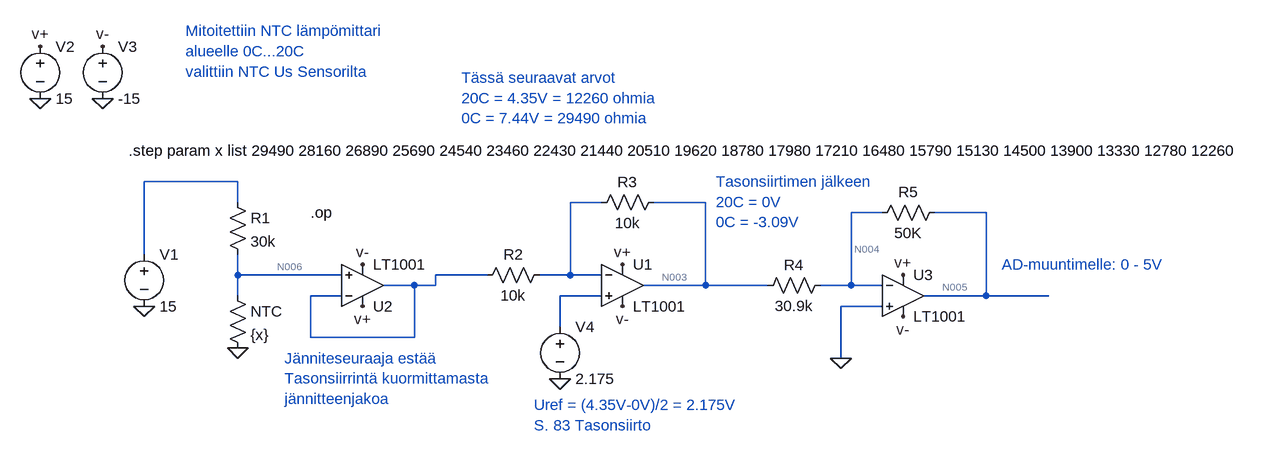
[diagram p0: schematic NTC_lämpötila_anturi.asc]
NTC_lämpötila_anturi.asc, the LTspice schematic file:
Version 4
SHEET 1 1972 680
WIRE -464 176 -608 176
WIRE -464 208 -464 176
WIRE 96 208 48 208
WIRE 256 208 176 208
WIRE 528 224 480 224
WIRE 688 224 608 224
WIRE -608 288 -608 176
WIRE -464 320 -464 288
WIRE -304 320 -464 320
WIRE -80 320 -160 320
WIRE 48 320 48 208
WIRE 48 320 0 320
WIRE 96 320 48 320
WIRE -192 336 -240 336
WIRE -160 336 -160 320
WIRE -160 336 -192 336
WIRE 256 336 256 208
WIRE 256 336 160 336
WIRE 352 336 256 336
WIRE 480 336 480 224
WIRE 480 336 432 336
WIRE 528 336 480 336
WIRE -464 352 -464 320
WIRE -304 352 -352 352
WIRE 96 352 32 352
WIRE 688 352 688 224
WIRE 688 352 592 352
WIRE 784 352 688 352
WIRE 528 368 464 368
WIRE 32 400 32 352
WIRE -352 416 -352 352
WIRE -192 416 -192 336
WIRE -192 416 -352 416
WIRE 464 448 464 368
FLAG -608 368 0
FLAG -464 432 0
FLAG -768 48 0
FLAG -672 48 0
FLAG 32 480 0
FLAG 128 368 v-
FLAG -672 -32 v-
FLAG 128 304 v+
FLAG -768 -32 v+
FLAG -272 368 v+
FLAG -272 304 v-
FLAG 560 384 v-
FLAG 560 320 v+
FLAG 464 448 0
SYMBOL res -480 192 R0
SYMATTR InstName R1
SYMATTR Value 30k
SYMBOL res -480 336 R0
SYMATTR InstName NTC
SYMATTR Value {x}
SYMBOL voltage -608 272 R0
WINDOW 123 0 0 Left 2
WINDOW 39 0 0 Left 2
SYMATTR InstName V1
SYMATTR Value 15
SYMBOL Opamps\\LT1001 128 272 R0
SYMATTR InstName U1
SYMBOL voltage -768 -48 R0
WINDOW 123 0 0 Left 2
WINDOW 39 0 0 Left 2
SYMATTR InstName V2
SYMATTR Value 15
SYMBOL voltage -672 -48 R0
WINDOW 123 0 0 Left 2
WINDOW 39 0 0 Left 2
SYMATTR InstName V3
SYMATTR Value -15
SYMBOL voltage 32 384 R0
WINDOW 123 0 0 Left 2
WINDOW 39 0 0 Left 2
SYMATTR InstName V4
SYMATTR Value 2.175
SYMBOL res 16 304 R90
WINDOW 0 0 56 VBottom 2
WINDOW 3 32 56 VTop 2
SYMATTR InstName R2
SYMATTR Value 10k
SYMBOL res 192 192 R90
WINDOW 0 0 56 VBottom 2
WINDOW 3 32 56 VTop 2
SYMATTR InstName R3
SYMATTR Value 10k
SYMBOL Opamps\\LT1001 -272 400 M180
SYMATTR InstName U2
SYMBOL Opamps\\LT1001 560 288 R0
SYMATTR InstName U3
SYMBOL res 448 320 R90
WINDOW 0 0 56 VBottom 2
WINDOW 3 32 56 VTop 2
SYMATTR InstName R4
SYMATTR Value 30.9k
SYMBOL res 624 208 R90
WINDOW 0 0 56 VBottom 2
WINDOW 3 32 56 VTop 2
SYMATTR InstName R5
SYMATTR Value 50K
TEXT -632 128 Left 2 !.step param x list 29490 28160 26890 25690 24540 23460 22430 21440 20510 19620 18780 17980 17210 16480 15790 15130 14500 13900 13330 12780 12260
TEXT -352 224 Left 2 !.op
TEXT -544 -56 Left 2 ;Mitoitettiin NTC lämpömittari\nalueelle 0C...20C\nvalittiin NTC Us Sensorilta
TEXT -120 16 Left 2 ;Tässä seuraavat arvot\n20C = 4.35V = 12260 ohmia\n0C = 7.44V = 29490 ohmia
TEXT 272 176 Left 2 ;Tasonsiirtimen jälkeen\n20C = 0V\n0C = -3.09V
TEXT 712 304 Left 2 ;AD-muuntimelle: 0 - 5V
TEXT -392 448 Left 2 ;Jänniteseuraaja estää \nTasonsiirrintä kuormittamasta\njännitteenjakoa
TEXT -8 520 Left 2 ;Uref = (4.35V-0V)/2 = 2.175V\nS. 83 Tasonsiirto

The netlist it stands for:
* NTC_lämpötila_anturi.asc
R1 N001 N006 30k
R§NTC N006 0 {x}
V1 N001 0 15
XU1 N008 N002 v+ v- N003 LT1001  ; pins In+ In- V+ V- OUT
V2 v+ 0 15
V3 v- 0 -15
V4 N008 0 2.175
R2 N002 N007 10k
R3 N003 N002 10k
XU2 N006 N007 v+ v- N007 LT1001  ; pins In+ In- V+ V- OUT
XU3 0 N004 v+ v- N005 LT1001  ; pins In+ In- V+ V- OUT
R4 N004 N003 30.9k
R5 N005 N004 50K
.step param x list 29490 28160 26890 25690 24540 23460 22430 21440 20510 19620 18780 17980 17210 16480 15790 15130 14500 13900 13330 12780 12260
.op
* Mitoitettiin NTC lämpömittari
* alueelle 0C...20C
* valittiin NTC Us Sensorilta
* Tässä seuraavat arvot
* 20C = 4.35V = 12260 ohmia
* 0C = 7.44V = 29490 ohmia
* Tasonsiirtimen jälkeen
* 20C = 0V
* 0C = -3.09V
* AD-muuntimelle: 0 - 5V
* Jänniteseuraaja estää
* Tasonsiirrintä kuormittamasta
* jännitteenjakoa
* Uref = (4.35V-0V)/2 = 2.175V
* S. 83 Tasonsiirto
.lib LTC.lib
.backanno
.end

* Results of the author's LTspice run, read from the files saved beside the schematic
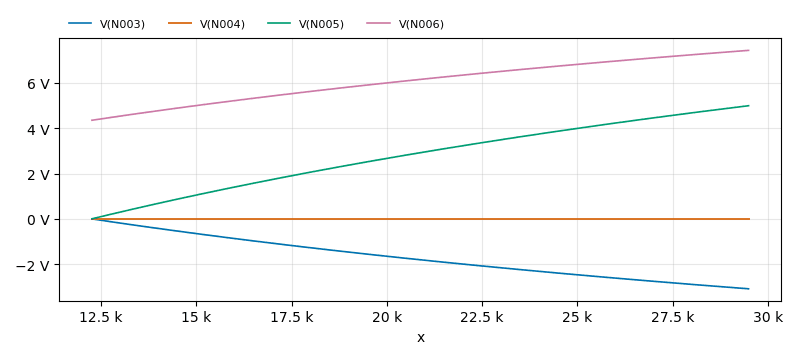
[diagram p1: Operating Point of NTC_lämpötila_anturi.asc, plotted from the saved traces]
* Operating Point, 1 run:
*   V(N003): -3.086 V at x=29.49 k, -1.627 mV at x=12.26 k, min -3.086 V, max -1.627 mV
*   V(N004): -6.694 µV at x=29.49 k, -3.529 nV at x=12.26 k, min -6.694 µV, max -3.529 nV
*   V(N005): 4.993 V at x=29.49 k, 2.632 mV at x=12.26 k, min 2.632 mV, max 4.993 V
*   V(N006): 7.436 V at x=29.49 k, 4.352 V at x=12.26 k, min 4.352 V, max 7.436 V
* From the log:
*   Semiconductor Device Operating Points:
*                           --- Diodes ---
*   Name:    d:u3:4      d:u3:1      d:u2:4      d:u2:1      d:u1:4
*   Model:    u3:di       u3:x        u2:di       u2:x        u1:di
*   Id:     -6.70e-15   -6.65e-15   -1.00e-14   -3.51e-14    4.17e-15
*   Vd:     -6.69e-06   -3.32e-03   -9.99e-06   -1.75e-02    4.16e-06
*   Req:     1.00e-09    1.00e-12    1.00e-09    1.00e-12    1.00e-09
*   CAP:     0.00e+00    0.00e+00    0.00e+00    0.00e+00    0.00e+00
*   Name:    d:u1:1
*   Model:    u1:x
*   Id:      4.17e-14
*   Vd:      2.09e-02
*   Req:     1.00e-12
*   CAP:     0.00e+00
*                           --- VDMOSFET Transistors ---
*   Name:        m:u3:2      m:u3:1      m:u2:2      m:u2:1      m:u1:2
*   Model:        u3:p        u3:n        u2:p        u2:n        u1:p
*   Id:         -2.20e-03    2.30e-03   -1.99e-03    2.52e-03   -2.57e-03
*   Vgs:         3.33e-03    3.33e-03    1.75e-02    1.75e-02   -2.09e-02
*   Vds:        -2.00e+01    1.00e+01   -2.24e+01    7.56e+00   -1.19e+01
*   Vth:         3.00e-01   -3.00e-01    3.00e-01   -3.00e-01    3.00e-01
*   Gm:          1.48e-02    1.52e-02    1.41e-02    1.59e-02    1.60e-02
*   Gds:         0.00e+00    0.00e+00    0.00e+00    0.00e+00    0.00e+00
*   Cgs:         0.00e+00    0.00e+00    0.00e+00    0.00e+00    0.00e+00
*   Cgd:         0.00e+00    0.00e+00    0.00e+00    0.00e+00    0.00e+00
*   Cbody:       0.00e+00    0.00e+00    0.00e+00    0.00e+00    0.00e+00
*   Name:        m:u1:1
*   Model:        u1:n
*   Id:          1.95e-03
*   Vgs:        -2.09e-02
*   Vds:         1.81e+01
*   Vth:        -3.00e-01
*   Gm:          1.40e-02
*   Gds:         0.00e+00
*   Cgs:         0.00e+00
*   Cgd:         0.00e+00
*   Cbody:       0.00e+00